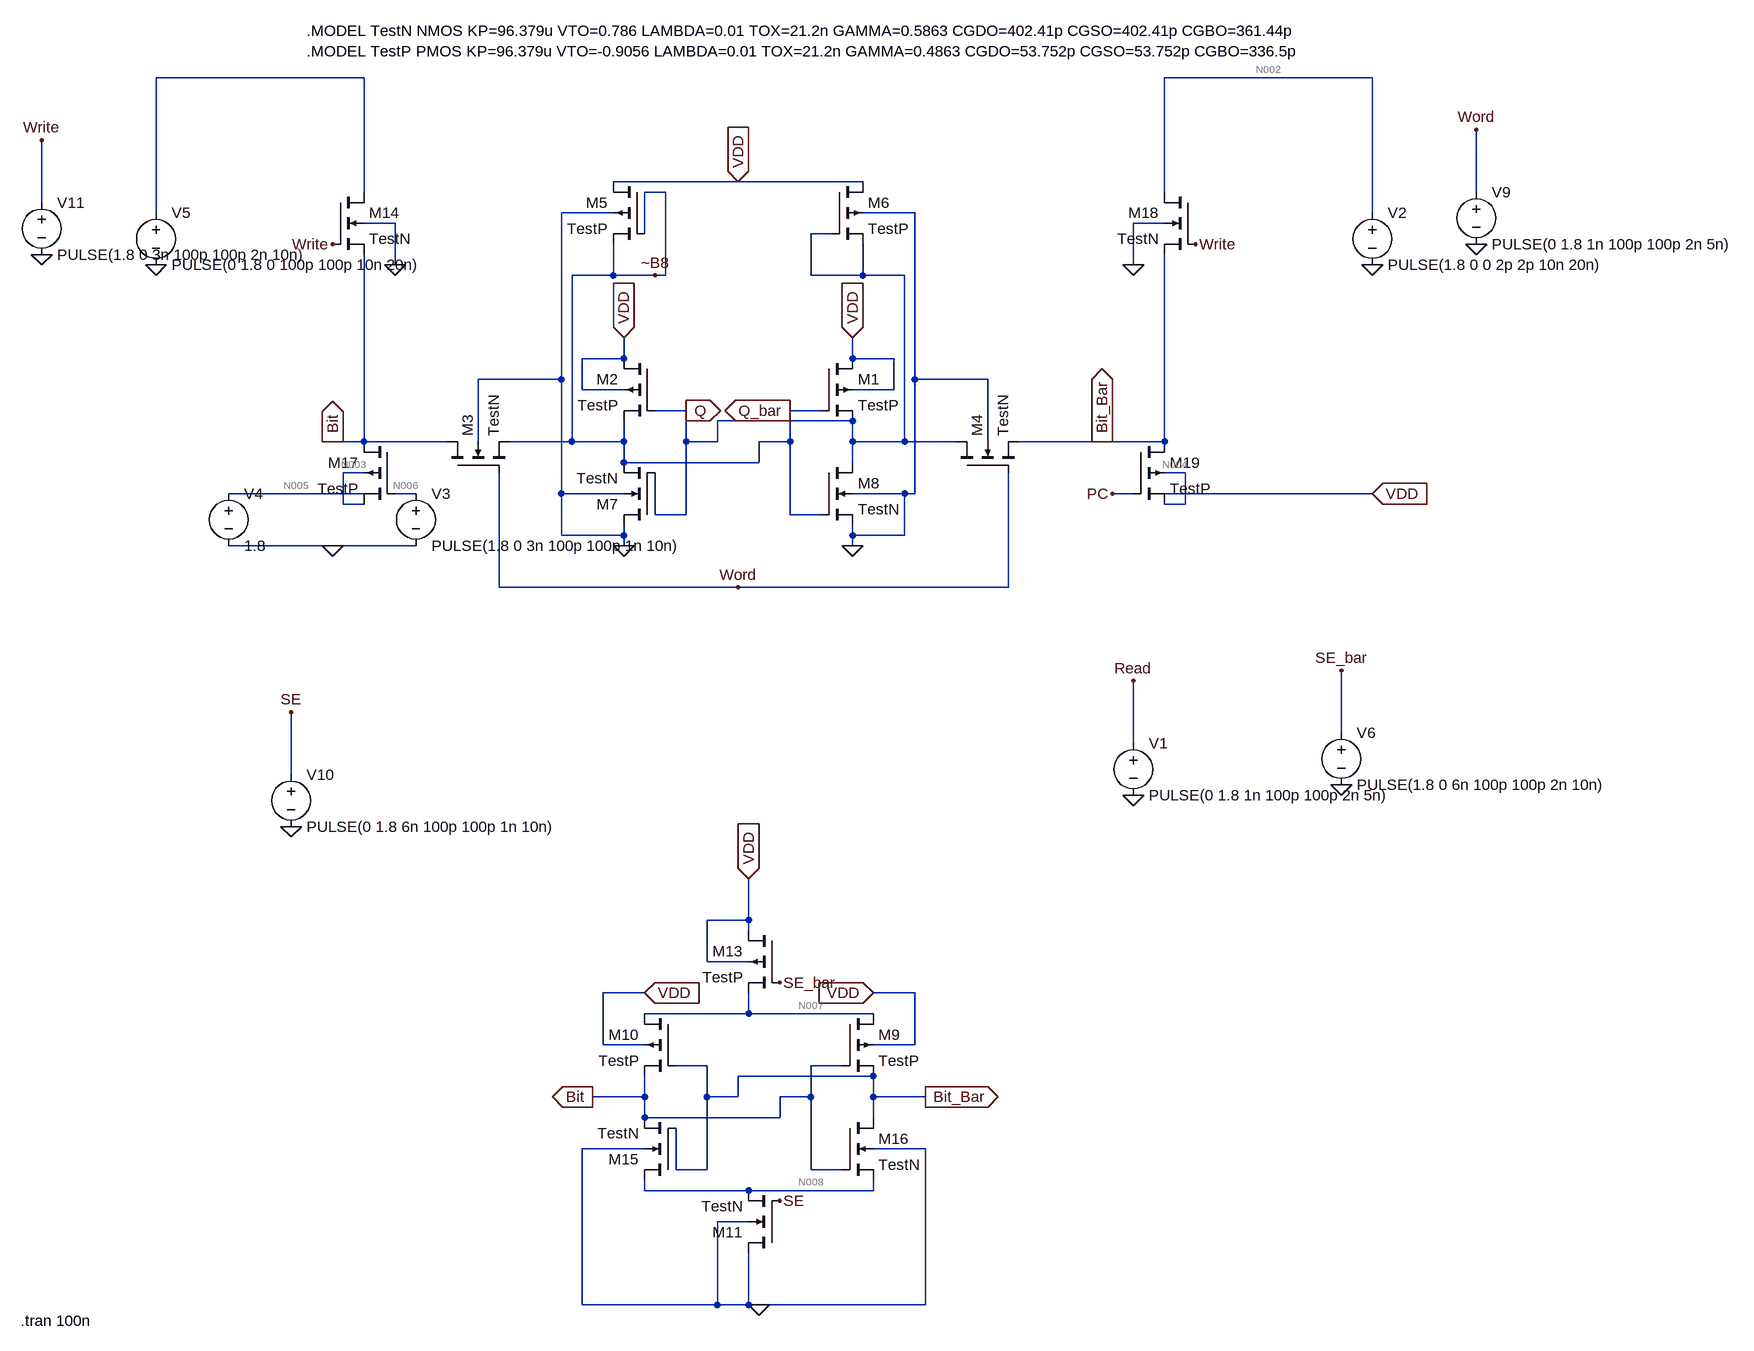
[diagram p0: schematic RAMFinal.asc]
RAMFinal.asc, the LTspice schematic file:
Version 4
SHEET 1 1864 1960
WIRE -384 32 -704 32
WIRE 1168 32 848 32
WIRE 192 192 0 192
WIRE 384 192 192 192
WIRE -384 208 -384 32
WIRE 80 208 48 208
WIRE 848 208 848 32
WIRE 1328 208 1328 112
WIRE -880 224 -880 128
WIRE -704 240 -704 32
WIRE 0 240 -80 240
WIRE 464 240 384 240
WIRE 1168 240 1168 32
WIRE -336 256 -384 256
WIRE 848 256 800 256
WIRE 48 272 48 208
WIRE 336 272 304 272
WIRE -336 320 -336 256
WIRE 800 320 800 256
WIRE 0 336 0 288
WIRE 0 336 -64 336
WIRE 64 336 0 336
WIRE 80 336 80 208
WIRE 80 336 64 336
WIRE 304 336 304 272
WIRE 384 336 384 288
WIRE 384 336 304 336
WIRE 448 336 384 336
WIRE 16 464 16 432
WIRE 16 464 -48 464
WIRE 368 464 368 432
WIRE 432 464 368 464
WIRE -80 496 -80 240
WIRE -80 496 -208 496
WIRE 464 496 464 240
WIRE 576 496 464 496
WIRE -48 512 -48 464
WIRE 16 512 -48 512
WIRE 432 512 432 464
WIRE 432 512 368 512
WIRE 112 544 64 544
WIRE 320 544 272 544
WIRE 368 560 160 560
WIRE -432 592 -448 592
WIRE -384 592 -384 304
WIRE -384 592 -432 592
WIRE -256 592 -384 592
WIRE -208 592 -208 496
WIRE -64 592 -64 336
WIRE -64 592 -160 592
WIRE 16 592 16 560
WIRE 16 592 -64 592
WIRE 112 592 112 544
WIRE 160 592 160 560
WIRE 160 592 112 592
WIRE 272 592 272 544
WIRE 272 592 224 592
WIRE 368 592 368 560
WIRE 448 592 448 336
WIRE 448 592 368 592
WIRE 528 592 448 592
WIRE 576 592 576 496
WIRE 752 592 624 592
WIRE 848 592 848 304
WIRE 848 592 752 592
WIRE 16 624 16 592
WIRE 224 624 224 592
WIRE 224 624 16 624
WIRE 368 624 368 592
WIRE -384 640 -416 640
WIRE 880 640 848 640
WIRE -384 672 -592 672
WIRE -304 672 -336 672
WIRE -80 672 -80 496
WIRE 16 672 -80 672
WIRE 448 672 368 672
WIRE 464 672 464 496
WIRE 464 672 448 672
WIRE 800 672 768 672
WIRE 1168 672 848 672
WIRE -416 688 -416 640
WIRE -384 688 -416 688
WIRE 880 688 880 640
WIRE 880 688 848 688
WIRE 64 704 64 640
WIRE 112 704 112 592
WIRE 112 704 64 704
WIRE 272 704 272 592
WIRE 320 704 272 704
WIRE -80 736 -80 672
WIRE 16 736 16 720
WIRE 16 736 -80 736
WIRE 368 736 368 720
WIRE 448 736 448 672
WIRE 448 736 368 736
WIRE -432 752 -592 752
WIRE -304 752 -432 752
WIRE 16 752 16 736
WIRE 368 752 368 736
WIRE -176 816 -176 640
WIRE 192 816 -176 816
WIRE 608 816 608 640
WIRE 608 816 192 816
WIRE 1120 1040 1120 944
WIRE 800 1056 800 960
WIRE -496 1104 -496 1008
WIRE 208 1328 208 1264
WIRE 208 1328 144 1328
WIRE 208 1344 208 1328
WIRE 144 1392 144 1328
WIRE 208 1392 144 1392
WIRE 48 1440 -16 1440
WIRE 464 1440 400 1440
WIRE 208 1472 208 1440
WIRE 208 1472 48 1472
WIRE 400 1472 208 1472
WIRE -16 1520 -16 1440
WIRE 48 1520 -16 1520
WIRE 464 1520 464 1440
WIRE 464 1520 400 1520
WIRE 144 1552 96 1552
WIRE 352 1552 304 1552
WIRE 400 1568 192 1568
WIRE 48 1600 48 1568
WIRE 48 1600 -32 1600
WIRE 144 1600 144 1552
WIRE 192 1600 192 1568
WIRE 192 1600 144 1600
WIRE 304 1600 304 1552
WIRE 304 1600 256 1600
WIRE 400 1600 400 1568
WIRE 480 1600 400 1600
WIRE 48 1632 48 1600
WIRE 256 1632 256 1600
WIRE 256 1632 48 1632
WIRE 400 1632 400 1600
WIRE 48 1680 -48 1680
WIRE 480 1680 400 1680
WIRE 96 1712 96 1648
WIRE 144 1712 144 1600
WIRE 144 1712 96 1712
WIRE 304 1712 304 1600
WIRE 352 1712 304 1712
WIRE 48 1744 48 1728
WIRE 208 1744 48 1744
WIRE 400 1744 400 1728
WIRE 400 1744 208 1744
WIRE 208 1792 160 1792
WIRE -48 1920 -48 1680
WIRE 160 1920 160 1792
WIRE 160 1920 -48 1920
WIRE 208 1920 208 1840
WIRE 208 1920 160 1920
WIRE 224 1920 208 1920
WIRE 480 1920 480 1680
WIRE 480 1920 224 1920
FLAG 368 752 0
FLAG 192 192 VDD
IOPIN 192 192 In
FLAG 368 432 VDD
IOPIN 368 432 In
FLAG 16 752 0
FLAG 16 432 VDD
IOPIN 16 432 In
FLAG 64 336 ~B8
FLAG 400 1440 VDD
IOPIN 400 1440 In
FLAG 48 1440 VDD
IOPIN 48 1440 In
FLAG 256 1760 SE
FLAG 208 1264 VDD
IOPIN 208 1264 In
FLAG 224 1920 0
FLAG 256 1424 SE_bar
FLAG 480 1600 Bit_Bar
IOPIN 480 1600 Out
FLAG -32 1600 Bit
IOPIN -32 1600 Out
FLAG 192 816 Word
FLAG -432 592 Bit
IOPIN -432 592 Out
FLAG 752 592 Bit_Bar
IOPIN 752 592 Out
FLAG -336 320 0
FLAG -432 288 Write
FLAG -432 752 0
FLAG -704 320 0
FLAG -880 304 0
FLAG -880 128 Write
FLAG 800 320 0
FLAG 896 288 Write
FLAG 1168 320 0
FLAG 1328 288 0
FLAG 1328 112 Word
FLAG 112 544 Q
IOPIN 112 544 Out
FLAG 272 544 Q_bar
IOPIN 272 544 Out
FLAG 800 1136 0
FLAG 800 960 Read
FLAG -496 1184 0
FLAG -496 1008 SE
FLAG 1168 672 VDD
IOPIN 1168 672 In
FLAG 768 672 PC
FLAG 1120 1120 0
FLAG 1120 944 SE_bar
SYMBOL pmos4 320 464 R0
SYMATTR InstName M1
SYMATTR Value TestP
SYMATTR Value2 l=10u w=40u
SYMBOL pmos4 64 464 M0
SYMATTR InstName M2
SYMATTR Value TestP
SYMATTR Value2 l=10u w=40u
SYMBOL nmos4 -256 640 R270
SYMATTR InstName M3
SYMATTR Value TestN
SYMATTR Value2 l=10u w=20u
SYMBOL nmos4 528 640 R270
SYMATTR InstName M4
SYMATTR Value TestN
SYMATTR Value2 l=10u w=20u
SYMBOL nmos4 64 720 R180
SYMATTR InstName M7
SYMATTR Value TestN
SYMATTR Value2 l=10u w=20u
SYMBOL nmos4 320 624 R0
SYMATTR InstName M8
SYMATTR Value TestN
SYMATTR Value2 l=10u w=20u
SYMBOL pmos4 352 1472 R0
SYMATTR InstName M9
SYMATTR Value TestP
SYMATTR Value2 l=10u w=40u
SYMBOL pmos4 96 1472 M0
SYMATTR InstName M10
SYMATTR Value TestP
SYMATTR Value2 l=10u w=40u
SYMBOL nmos4 96 1728 R180
SYMATTR InstName M15
SYMATTR Value TestN
SYMATTR Value2 l=10u w=20u
SYMBOL nmos4 352 1632 R0
SYMATTR InstName M16
SYMATTR Value TestN
SYMATTR Value2 l=10u w=20u
SYMBOL nmos4 256 1840 R180
SYMATTR InstName M11
SYMATTR Value TestN
SYMATTR Value2 l=10u w=20u
SYMBOL pmos4 256 1344 M0
SYMATTR InstName M13
SYMATTR Value TestP
SYMATTR Value2 l=10u w=40u
SYMBOL nmos4 -432 208 R0
SYMATTR InstName M14
SYMATTR Value TestN
SYMATTR Value2 l=10u w=20u
SYMBOL pmos4 -336 592 M0
SYMATTR InstName M17
SYMATTR Value TestP
SYMATTR Value2 l=10u w=40u
SYMBOL voltage -304 656 R0
WINDOW 123 0 0 Left 0
WINDOW 39 0 0 Left 0
SYMATTR InstName V3
SYMATTR Value PULSE(1.8 0 3n 100p 100p 1n 10n)
SYMBOL voltage -592 656 R0
WINDOW 123 0 0 Left 0
WINDOW 39 0 0 Left 0
SYMATTR InstName V4
SYMATTR Value 1.8
SYMBOL nmos4 896 208 M0
SYMATTR InstName M18
SYMATTR Value TestN
SYMATTR Value2 l=10u w=20u
SYMBOL pmos4 800 592 R0
SYMATTR InstName M19
SYMATTR Value TestP
SYMATTR Value2 l=10u w=40u
SYMBOL voltage 1328 192 R0
WINDOW 123 0 0 Left 0
WINDOW 39 0 0 Left 0
SYMATTR InstName V9
SYMATTR Value PULSE(0 1.8 1n 100p 100p 2n 5n)
SYMBOL voltage 800 1040 R0
WINDOW 123 0 0 Left 0
WINDOW 39 0 0 Left 0
SYMATTR InstName V1
SYMATTR Value PULSE(0 1.8 1n 100p 100p 2n 5n)
SYMBOL voltage -496 1088 R0
WINDOW 123 0 0 Left 0
WINDOW 39 0 0 Left 0
SYMATTR InstName V10
SYMATTR Value PULSE(0 1.8 6n 100p 100p 1n 10n)
SYMBOL voltage -880 208 R0
WINDOW 123 0 0 Left 0
WINDOW 39 0 0 Left 0
SYMATTR InstName V11
SYMATTR Value PULSE(1.8 0 3n 100p 100p 2n 10n)
SYMBOL voltage -704 224 R0
WINDOW 123 0 0 Left 0
WINDOW 39 0 0 Left 0
SYMATTR InstName V5
SYMATTR Value PULSE(0 1.8 0 100p 100p 10n 20n)
SYMBOL voltage 1168 224 R0
WINDOW 123 0 0 Left 0
WINDOW 39 0 0 Left 0
SYMATTR InstName V2
SYMATTR Value PULSE(1.8 0 0 2p 2p 10n 20n)
SYMBOL voltage 1120 1024 R0
WINDOW 123 0 0 Left 0
WINDOW 39 0 0 Left 0
SYMATTR InstName V6
SYMATTR Value PULSE(1.8 0 6n 100p 100p 2n 10n)
SYMBOL pmos4 48 192 M0
SYMATTR InstName M5
SYMATTR Value TestP
SYMATTR Value2 l=10u w=40u
SYMBOL pmos4 336 192 R0
SYMATTR InstName M6
SYMATTR Value TestP
SYMATTR Value2 l=10u w=40u
TEXT -472 -40 Left 2 !.MODEL TestN NMOS KP=96.379u VTO=0.786 LAMBDA=0.01 TOX=21.2n GAMMA=0.5863 CGDO=402.41p CGSO=402.41p CGBO=361.44p\n.MODEL TestP PMOS KP=96.379u VTO=-0.9056 LAMBDA=0.01 TOX=21.2n GAMMA=0.4863 CGDO=53.752p CGSO=53.752p CGBO=336.5p
TEXT -912 1944 Left 2 !.tran 100n

The netlist it stands for:
* RAMFinal.asc
M1 VDD Q_bar Q VDD TestP l=10u w=40u
M2 VDD Q Q_bar VDD TestP l=10u w=40u
M3 Bit Word Q_bar 0 TestN l=10u w=20u
M4 Q Word Bit_Bar 0 TestN l=10u w=20u
M7 0 Q Q_bar 0 TestN l=10u w=20u
M8 Q Q_bar 0 0 TestN l=10u w=20u
M9 N007 Bit Bit_Bar VDD TestP l=10u w=40u
M10 N007 Bit_Bar Bit VDD TestP l=10u w=40u
M15 N008 Bit_Bar Bit 0 TestN l=10u w=20u
M16 Bit_Bar Bit N008 0 TestN l=10u w=20u
M11 0 SE N008 0 TestN l=10u w=20u
M13 VDD SE_bar N007 VDD TestP l=10u w=40u
M14 N001 Write Bit 0 TestN l=10u w=20u
M17 Bit N006 N003 N003 TestP l=10u w=40u
V3 N006 0 PULSE(1.8 0 3n 100p 100p 1n 10n)
V4 N005 0 1.8
M18 N002 Write Bit_Bar 0 TestN l=10u w=20u
M19 Bit_Bar PC N004 N004 TestP l=10u w=40u
V9 Word 0 PULSE(0 1.8 1n 100p 100p 2n 5n)
V1 Read 0 PULSE(0 1.8 1n 100p 100p 2n 5n)
V10 SE 0 PULSE(0 1.8 6n 100p 100p 1n 10n)
V11 Write 0 PULSE(1.8 0 3n 100p 100p 2n 10n)
V5 N001 0 PULSE(0 1.8 0 100p 100p 10n 20n)
V2 N002 0 PULSE(1.8 0 0 2p 2p 10n 20n)
V6 SE_bar 0 PULSE(1.8 0 6n 100p 100p 2n 10n)
M5 VDD Q_bar Q_bar 0 TestP l=10u w=40u
M6 VDD Q Q 0 TestP l=10u w=40u
.model NMOS NMOS
.model PMOS PMOS
.lib standard.mos
.MODEL TestN NMOS KP=96.379u VTO=0.786 LAMBDA=0.01 TOX=21.2n GAMMA=0.5863 CGDO=402.41p CGSO=402.41p CGBO=361.44p
.MODEL TestP PMOS KP=96.379u VTO=-0.9056 LAMBDA=0.01 TOX=21.2n GAMMA=0.4863 CGDO=53.752p CGSO=53.752p CGBO=336.5p
.tran 100n
.backanno
.end

* Results of the author's LTspice run, read from the files saved beside the schematic
* Operating Point, zero values left out:
*   V(vdd) = 373 mV
*   V(q_bar) = 93.51 mV
*   V(q) = 117.6 mV
*   V(bit) = 4.985 nV
*   V(bit_bar) = 764 mV
*   V(n007) = 375.5 mV
*   V(n008) = 122.4 mV
*   V(se_bar) = 1.8 V
*   V(write) = 1.8 V
*   V(n006) = 1.8 V
*   V(n003) = 4.985 nV
*   V(n005) = 1.8 V
*   V(n002) = 1.8 V
*   V(n004) = 764 mV
*   Ib(M9) = -36.69 nA
*   Is(M9) = 36.69 nA
*   Id(M5) = 18.35 nA
*   Ib(M5) = -18.35 nA
*   Id(M6) = 18.35 nA
*   Ib(M6) = -18.35 nA
*   Is(M4) = 1.42 pA
*   Id(M16) = 1.416 pA
*   Id(M18) = 36.7 nA
*   Ib(M18) = -2.584 pA
*   Is(M18) = -36.7 nA
*   I(V2) = -36.7 nA
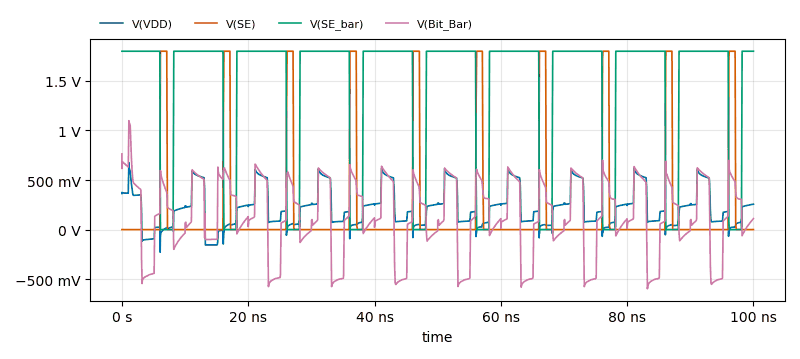
[diagram p1: Transient Analysis of RAMFinal.asc, plotted from the saved traces]
* Transient Analysis, 1 run:
*   V(VDD): min -228.1 mV, max 676 mV, average 211.5 mV, rms 286.1 mV, last 256.3 mV
*   V(SE): min 0 V, max 1.8 V, average 197.2 mV, rms 588 mV, last 0 V
*   V(SE_bar): min 0 V, max 1.8 V, average 1.422 V, rms 1.597 V, last 1.8 V
*   V(Bit_Bar): min -598.1 mV, max 1.099 V, average 129.9 mV, rms 397.8 mV, last 110.3 mV